# Altium schematic sheet MiniSat_Sensors_main.SchDoc
size A4
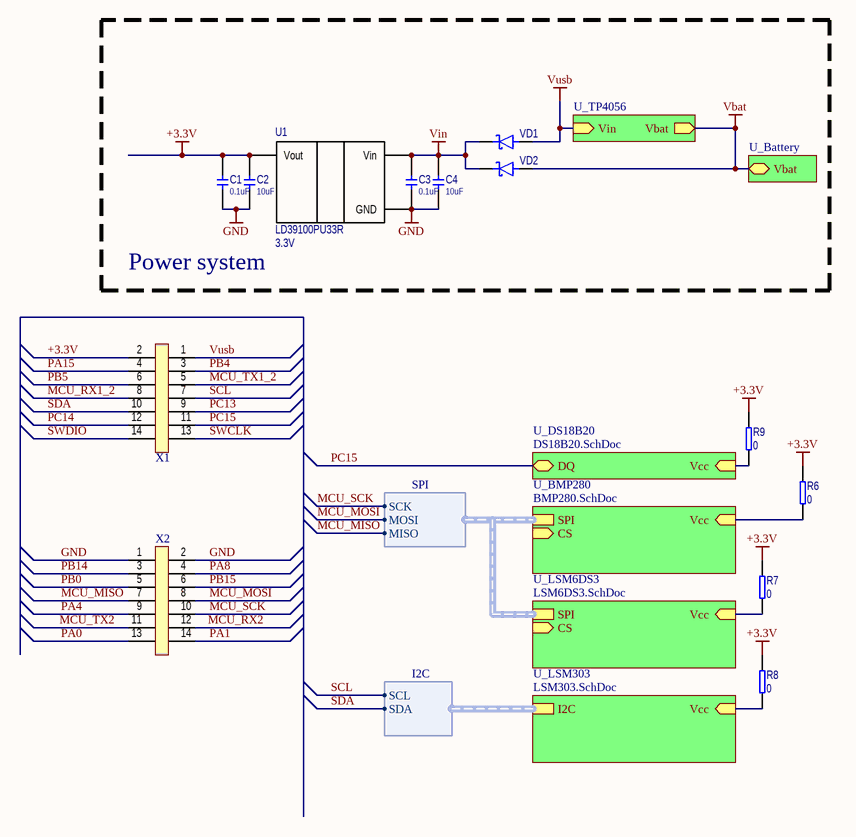
[diagram p0: MiniSat_Sensors_main.SchDoc]

## Parts
C1  value 0.1uF  [CERCAP 0402]
C2  value 10uF  [CERCAP 0603]
C3  value 0.1uF  [CERCAP 0402]
C4  value 10uF  [CERCAP 0603]
R6  value 0  [RES 0402]
R7  value 0  [RES 0402]
R8  value 0  [RES 0402]
R9  value 0  [RES 0402]
U1  LD39100PU33R  value 3.3V  [DFN-6]
VD1  (no value)  [SOD-123]
VD2  (no value)  [SOD-123]
X1  Header  [PC-14_A]  (value not drawn)
X2  Header  [PC-14_A]  (value not drawn)

## Blocks framed on the sheet
Power system: C1-C4 U1 VD1 VD2

## Sub-sheets
U_Battery = Battery.SchDoc: Vbat (bidir)
U_BMP280 = BMP280.SchDoc: CS (in), Vcc (in), SPI (harness SPI)
U_DS18B20 = DS18B20.SchDoc: DQ (bidir), Vcc (in)
U_LSM6DS3 = LSM6DS3.SchDoc: CS (in), Vcc (in), SPI (harness SPI)
U_LSM303 = LSM303.SchDoc: Vcc (in), I2C (harness I2C)
U_TP4056 = TP4056.SchDoc: Vin (in), Vbat (out)

## Harnesses
I2C: SCL, SDA
SPI: SCK, MOSI, MISO

## Nets
+3.3V: C1.2 C2.2 R6.2 R7.2 R8.2 R9.2 U1.Vout X1.2
GND: C1.1 C2.1 C3.1 C4.1 U1.ADJ/GND(GND) X2.1 X2.2
Vbat: VD2.A(Anode) ; sheet U_Battery/Vbat, sheet U_TP4056/Vbat
Vin: C3.2 C4.2 U1.Vin VD1.C(Cathode) VD2.C(Cathode)
Vusb: VD1.A(Anode) X1.1 ; sheet U_TP4056/Vin
MCU_MISO: X2.7 ; sheet U_BMP280/SPI.MISO
MCU_MOSI: X2.8 ; sheet U_BMP280/SPI.MOSI
MCU_RX1_2: X1.8
MCU_RX2: X2.12
MCU_SCK: X2.10 ; sheet U_BMP280/SPI.SCK
MCU_TX1_2: X1.5
MCU_TX2: X2.11
PA0: X2.13
PA1: X2.14
PA4: X2.9
PA8: X2.4
PA15: X1.4
PB0: X2.5
PB4: X1.3
PB5: X1.6
PB14: X2.3
PB15: X2.6
PC13: X1.9
PC14: X1.12
PC15: X1.11 ; sheet U_DS18B20/DQ
SCL: X1.7 ; sheet U_LSM303/I2C.SCL
SDA: X1.10 ; sheet U_LSM303/I2C.SDA
SWCLK: X1.13
SWDIO: X1.14
NetR6_1: R6.1 ; sheet U_BMP280/Vcc
NetR7_1: R7.1 ; sheet U_LSM6DS3/Vcc
NetR8_1: R8.1 ; sheet U_LSM303/Vcc
NetR9_1: R9.1 ; sheet U_DS18B20/Vcc

## Buses and harness runs
harness sheet U_BMP280/SPI = sheet U_LSM6DS3/SPI

## Library data of the parts
C1-C4 = !Capacitor: Capacitor; IsSMT: NoSMT; Diel: X7R; Voltage: *
R6-R9 = !Resistor: Resistor; IsSMT: NoSMT
U1 = !Generic LDO: generic ldo; pin to pad: ADJ/GND>2+TH Vin>1+6 Vout>4; IsSMT: NoSMT
VD1 VD2 = DiodeS: Diode Shottky; IsSMT: NoSMT
X1 X2 = Header 7x2: 7x2 header; Order: PC104-14